# Altium schematic sheet USB - Wireless.SchDoc: USB - Wireless
size A3; Author: Vi Tín; SheetNumber: 10; SheetTotal: 15
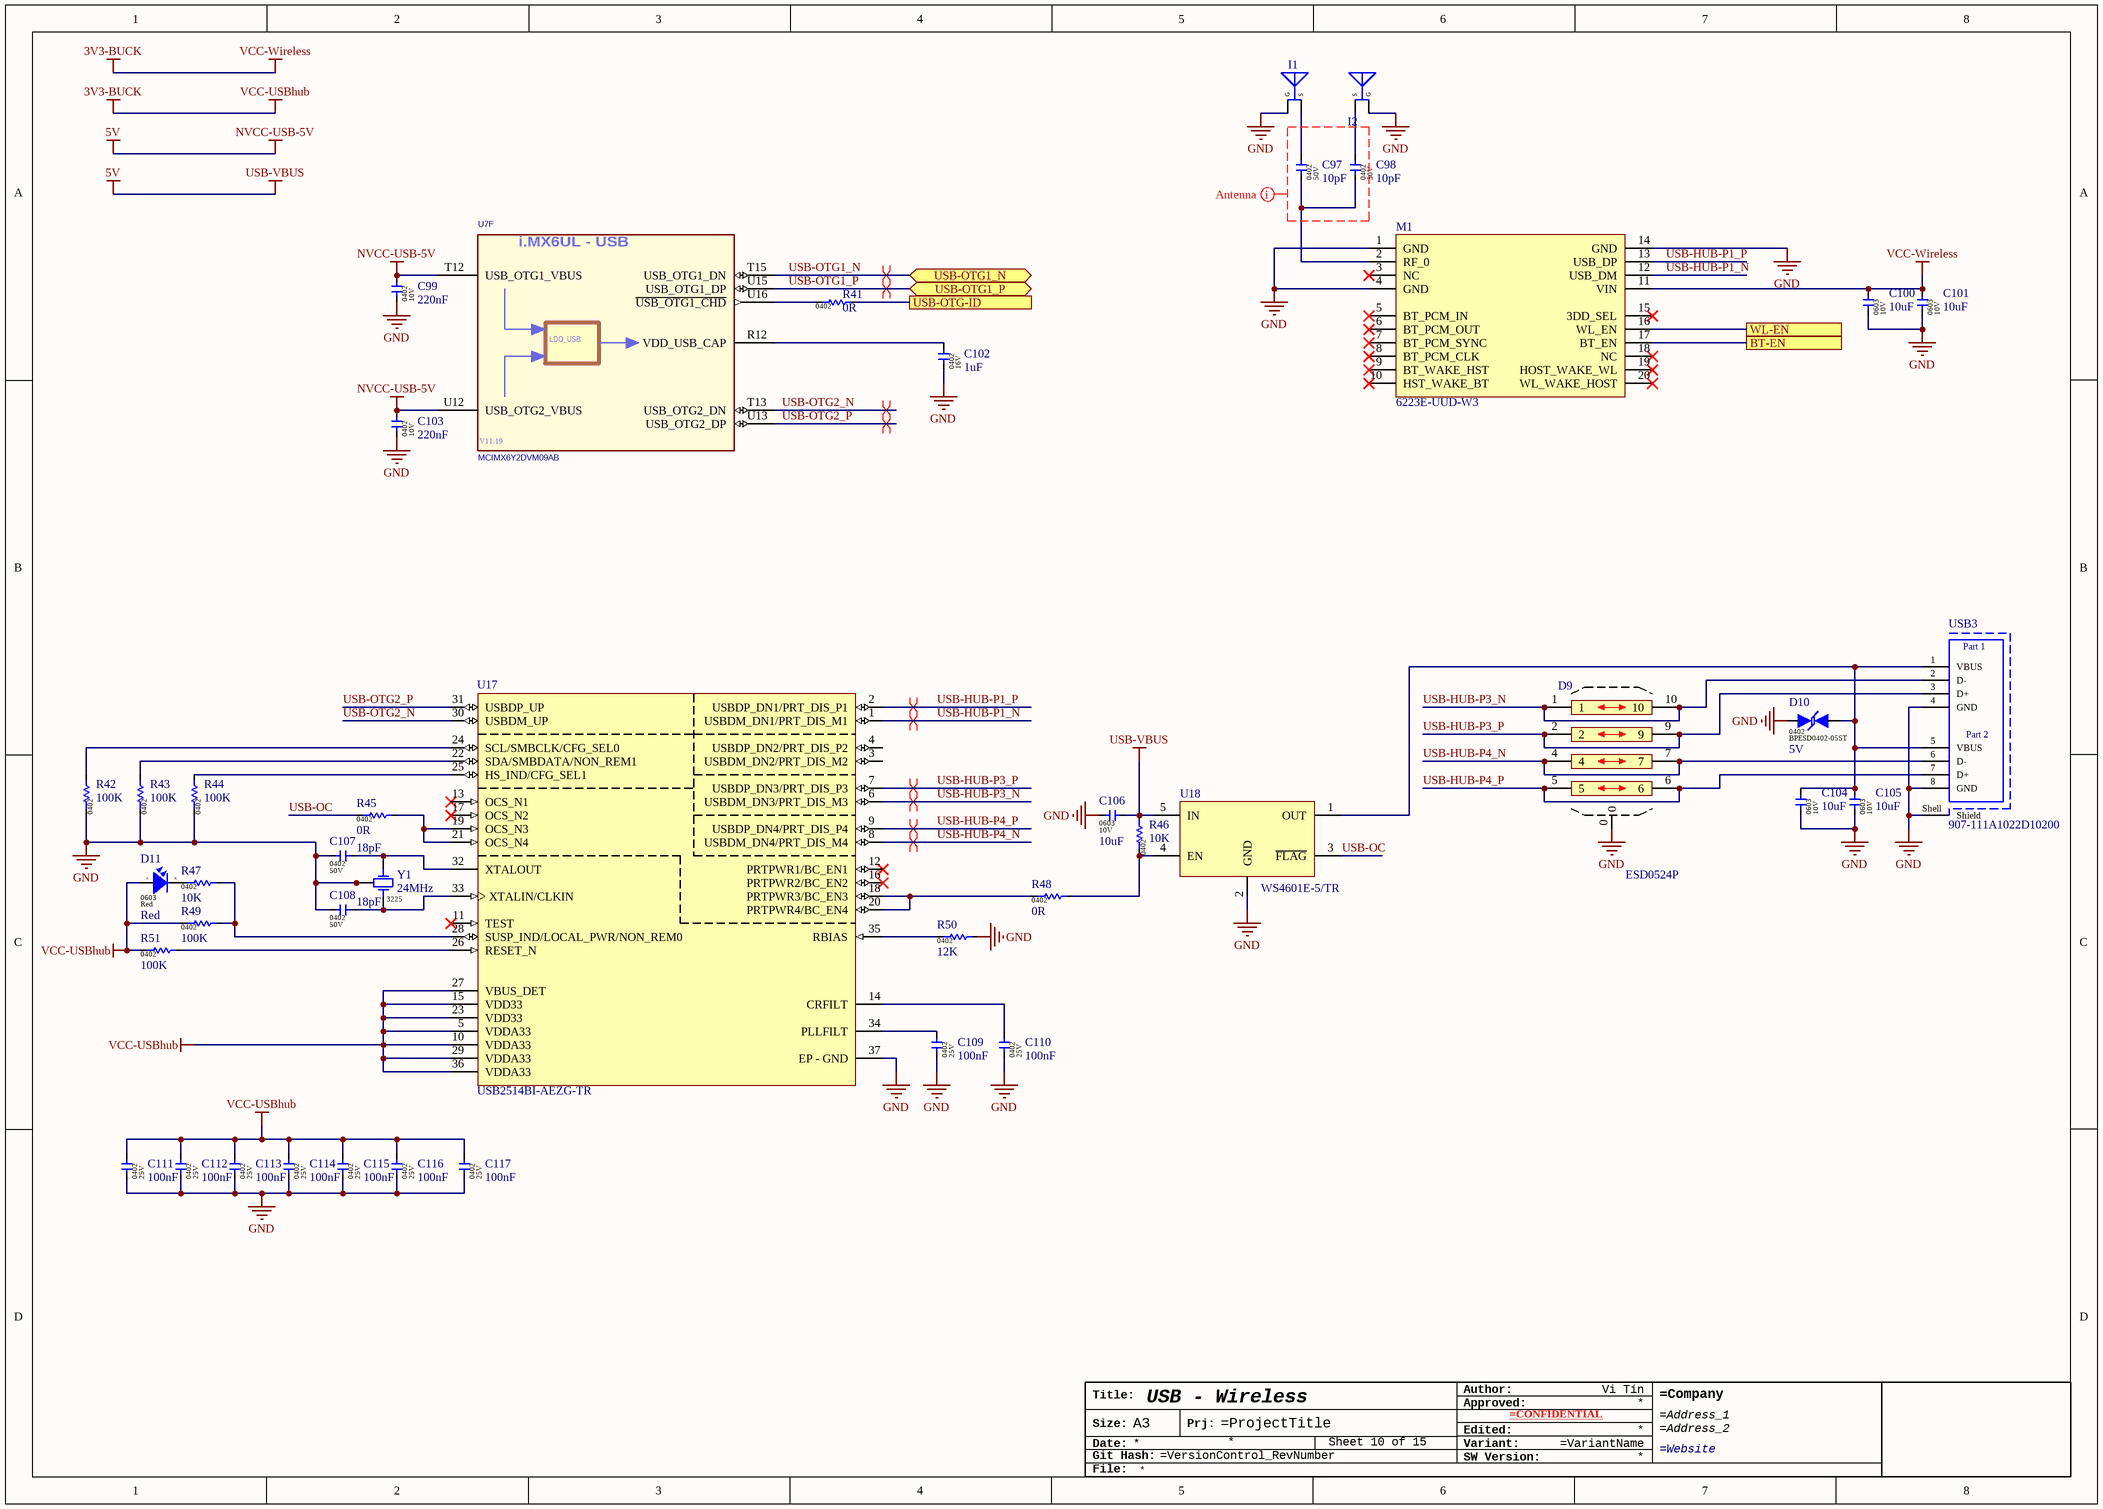
[diagram p0: USB - Wireless.SchDoc]

## Parts
*?  TitleBlock_Generic  (value not drawn)  (graphical)
C97  10pF  [CAP-0402]
C98  10pF  [CAP-0402]
C99  220nF  [CAP-0402]
C100  10uF  [CAP-0603]
C101  10uF  [CAP-0603]
C102  1uF  [CAP-0402]
C103  220nF  [CAP-0402]
C104  10uF  [CAP-0603]
C105  10uF  [CAP-0603]
C106  10uF  [CAP-0603]
C107  18pF  [CAP-0402]
C108  18pF  [CAP-0402]
C109  100nF  [CAP-0402]
C110  100nF  [CAP-0402]
C111  100nF  [CAP-0402]
C112  100nF  [CAP-0402]
C113  100nF  [CAP-0402]
C114  100nF  [CAP-0402]
C115  100nF  [CAP-0402]
C116  100nF  [CAP-0402]
C117  100nF  [CAP-0402]
D9  ESD0524P  [DFN2510]
D10  5V  [Diode-0402]
D11  Red  [LED-0603 RED]
I1  SP-RF-001  [ipex 2.6x2.6]  (value not drawn)
I2  AN043  [PCB antenna - AN043]  (value not drawn)  (net tie, no BOM)
M1  6223E-UUD-W3  [RTL8723DU Module]
R41  0R  [RES-0402]
R42  100K  [RES-0402]
R43  100K  [RES-0402]
R44  100K  [RES-0402]
R45  0R  [RES-0402]
R46  10K  [RES-0402]
R47  10K  [RES-0402]
R48  0R  [RES-0402]
R49  100K  [RES-0402]
R50  12K  [RES-0402]
R51  100K  [RES-0402]
U7  MCIMX6Y2DVM09AB  [IMX6ULL]  (part F of 11)
U17  USB2514BI-AEZG-TR  [QFN36-6X6MM_PAD]
U18  WS4601E-5/TR  [SOT23-5]
USB3  907-111A1022D10200  [2 Female USB]
Y1  24MHz  [Crystal-3225]

## Ports
BT-EN, USB-OTG1_N (bidir), USB-OTG1_P (bidir), USB-OTG-ID, WL-EN

## Nets
3V3-BUCK: C100.2 C101.2 C111.2 C112.2 C113.2 C114.2 C115.2 C116.2 C117.2 D11.2(Anode) M1.11(VIN) R49.1 R51.1 U17.5(VDDA33) U17.10(VDDA33) U17.15(VDD33) U17.23(VDD33) U17.27(VBUS_DET) U17.29(VDDA33) U17.36(VDDA33)  [also labelled VCC-USBhub, VCC-Wireless]
5V: C99.2 C103.2 C106.2 R46.2 U7.T12(USB_OTG1_VBUS) U7.U12(USB_OTG2_VBUS) U18.5(IN)  [also labelled NVCC-USB-5V, USB-VBUS]
GND: C99.1 C100.1 C101.1 C102.1 C103.1 C104.1 C105.1 C106.1 C107.1 C108.1 C109.1 C110.1 C111.1 C112.1 C113.1 C114.1 C115.1 C116.1 C117.1 D9.0 D10.1 I1.0(G) I2.0(G) M1.1(GND) M1.4(GND) M1.14(GND) R42.1 R43.1 R44.1 R50.2 U17.37(EP_-_GND) U18.2(GND) USB3.4(GND) USB3.8(GND) USB3.Shell(Shield) Y1.2(GND) Y1.4(GND)
BT-EN: M1.17(BT_EN) ; port BT-EN
USB-HUB-P1_N: M1.12(USB_DM) U17.1(USBDM_DN1/PRT_DIS_M1)
USB-HUB-P1_P: M1.13(USB_DP) U17.2(USBDP_DN1/PRT_DIS_P1)
USB-HUB-P3_N: D9.1 D9.10 U17.6(USBDM_DN3/PRT_DIS_M3) USB3.2(D-)
USB-HUB-P3_P: D9.2 D9.9 U17.7(USBDP_DN3/PRT_DIS_P3) USB3.3(D+)
USB-HUB-P4_N: D9.4 D9.7 U17.8(USBDM_DN4/PRT_DIS_M4) USB3.6(D-)
USB-HUB-P4_P: D9.5 D9.6 U17.9(USBDP_DN4/PRT_DIS_P4) USB3.7(D+)
USB-OC: R45.1 U18.3(~{FLAG})
USB-OTG1_N: U7.T15(USB_OTG1_DN) ; port USB-OTG1_N
USB-OTG1_P: U7.U15(USB_OTG1_DP) ; port USB-OTG1_P
USB-OTG2_N: U7.T13(USB_OTG2_DN) U17.30(USBDM_UP)
USB-OTG2_P: U7.U13(USB_OTG2_DP) U17.31(USBDP_UP)
USB-OTG-ID: R41.2 ; port USB-OTG-ID
WL-EN: M1.16(WL_EN) ; port WL-EN
NetC97_1: C97.1 C98.1 M1.2(RF_0)
NetC97_2: C97.2 I1.1(S)
NetC98_2: C98.2 I2.1(S)
NetC102_2: C102.2 U7.R12(VDD_USB_CAP)
NetC104_2: C104.2 C105.2 D10.2 U18.1(OUT) USB3.1(VBUS) USB3.5(VBUS)
NetC107_2: C107.2 U17.32(XTALOUT) Y1.1(X1)
NetC108_2: C108.2 U17.33(XTALIN/CLKIN) Y1.3(X2)
NetC109_2: C109.2 U17.34(PLLFILT)
NetC110_2: C110.2 U17.14(CRFILT)
NetD11_1: D11.1(Cathode) R47.1
NetR41_1: R41.1 U7.U16(~{USB_OTG1_CHD})
NetR42_2: R42.2 U17.24(SCL/SMBCLK/CFG_SEL0)
NetR43_2: R43.2 U17.22(SDA/SMBDATA/NON_REM1)
NetR44_2: R44.2 U17.25(HS_IND/CFG_SEL1)
NetR45_2: R45.2 U17.19(OCS_N3) U17.21(OCS_N4)
NetR46_1: R46.1 R48.2 U18.4(EN)
NetR47_2: R47.2 R49.2 U17.28(SUSP_IND/LOCAL_PWR/NON_REM0)
NetR48_1: R48.1 U17.18(PRTPWR3/BC_EN3) U17.20(PRTPWR4/BC_EN4)
NetR50_1: R50.1 U17.35(RBIAS)
NetR51_2: R51.2 U17.26(RESET_N)

Not connected (* = marked no-connect by the designer): M1 3(NC)* 5(BT_PCM_IN)* 6(BT_PCM_OUT)* 7(BT_PCM_SYNC)* 8(BT_PCM_CLK)* 9(BT_WAKE_HST)* 10(HST_WAKE_BT)* 15(3DD_SEL)* 18(NC)* 19(HOST_WAKE_WL)* 20(WL_WAKE_HOST)*; U17 3(USBDM_DN2/PRT_DIS_M2) 4(USBDP_DN2/PRT_DIS_P2) 11(TEST)* 12(PRTPWR1/BC_EN1)* 13(OCS_N1)* 16(PRTPWR2/BC_EN2)* 17(OCS_N2)*

## Layout directives
differential pair; differential pair class DIFF90_USB: USB-HUB-P1_N, USB-HUB-P1_P, USB-HUB-P3_N, USB-HUB-P3_P, USB-HUB-P4_N, USB-HUB-P4_P, USB-OTG1_N, USB-OTG1_P, USB-OTG2_N, USB-OTG2_P
net class Antenna: (no net found under the mark)

## Notes on the sheet
- (in symbol 19-217/R6C-AL1M2VY/3T) A; K
- (in symbol 907-111A1022D10200) Part 1; Part 2
- (in symbol MCIMX6Y2DVM09AB, part F) i.MX6UL - USB; LDO_USB; V11.19
- (in symbol TitleBlock_Generic) Author:; Title:; Approved:; Size:; A3; Prj:; Edited:; Date:; Variant:; SW Version:; Git Hash:; File:

## Library data of the parts
C97 C98 = 0402N100J500CT: 10pF ±5% 50V NP0 0402 Multilayer Ceramic Capacitors MLCC - SMD/SMT RoHS; Manufacture: WALSIN; Package / Case: 0402; Component type: Capacitor; Manufacture part: 0402N100J500CT; Capacitor value: 10pF; Voltage: 50V; Package: 0402
C99 C103 = 0402X224J100CT: 220nF ±5% 10V X5R 0402 Multilayer Ceramic Capacitors MLCC - SMD/SMT RoHS; Manufacture: WALSIN; Package / Case: 0402; Component type: Capacitor; Manufacture part: 0402X224J100CT; Capacitor value: 220nF; Voltage: 10V; Package: 0402
C100 C101 C104-C106 = 0603X106M100CT: 10uF ±20% 10V X5R 0603 Multilayer Ceramic Capacitors MLCC - SMD/SMT RoHS; Manufacture: WALSIN; Package / Case: 0402; Component type: Capacitor; Manufacture part: 0603X106M100CT; Capacitor value: 10uF; Voltage: 10V; Package: 0603
C102 = 0402X105K160CT: 1uF ±10% 16V X5R 0402 Multilayer Ceramic Capacitors MLCC - SMD/SMT RoHS; Manufacture: WALSIN; Package / Case: 0402; Component type: Capacitor; Manufacture part: 0402X105K160CT; Capacitor value: 1uF; Voltage: 16V; Package: 0402
C107 C108 = 0402N180J500CT: 18pF ±5% 50V NP0 0402 Multilayer Ceramic Capacitors MLCC - SMD/SMT RoHS; Manufacture: WALSIN; Package / Case: 0402; Component type: Capacitor; Manufacture part: 0402N180J500CT; Capacitor value: 18pF; Voltage: 50V; Package: 0402
C109-C117 = 0402X104K250CT: 100nF ±10% 25V X5R 0402 Multilayer Ceramic Capacitors MLCC - SMD/SMT RoHS; Manufacture: WALSIN; Package / Case: 0402; Component type: Capacitor; Manufacture part: 0402X104K250CT; Capacitor value: 100nF; Voltage: 25V; Package: 0402
D9 = ESD0524P: DFN2510 ESD Protection Devices ROHS; Manufacture: MDD（Microdiode Electronics）; Type: TVS/ESD Bi diode; Diode value: 5V; Manufacture part: ESD0524P; Package: DFN2510; Datasheet: https://datasheet.lcsc.com/lcsc/2009281808_MDD-Microdiode-Electronics--ESD0524P_C840786.pdf
D10 = BPESD0402-05ST: Bidirectional 40V 5V (Max) 0402 ESD Protection Devices ROHS; Manufacture: BORN; Manufacture part: BPESD0402-05ST; Type: TVS/ESD Bi diode; Diode value: 5V; Package: 0402; Datasheet: https://datasheet.lcsc.com/lcsc/1811031631_BORN-BPESD0402-05ST_C316059.pdf
D11 = 19-217/R6C-AL1M2VY/3T: Red 617.5~633.5nm 0603 Light Emitting Diodes (LED) RoHS; Manufacture: Everlight Elec; Package / Case: 0402; Component type: Led; Part reference: *; Manufacture part: 19-217/R6C-AL1M2VY/3T; Color: Red; Package: 0603
I1 = SP-RF-001: 2.6x2.6x1.25mm RF Connectors/Coaxial Connectors RoHS; Manufacture: XUNPU; Manufacture part: SP-RF-001; Type: IPEX; Datasheet: https://datasheet.lcsc.com/lcsc/2012251035_XUNPU-SP-RF-001_C920232.pdf
I2 = AN043: AN043 F-2.4Ghz BW-101Mhz 15x6mm; Manufacture part: AN043; Manufacture: N/A; Type: PCB Antenna; Datasheet: https://www.ti.com/lit/an/swra351a/swra351a.pdf?ts=1625122688525&ref_url=https%253A%252F%252Fwww.google.com%252F
M1 = 6223E-UUD-W3: USB 2.4GHz WiFi Bluetooth Module; Manufacture: FN-LINK; Manufacture part: 6223E-UUD-W3; Package: N/A
R41 R45 R48 = WR04X0000FTL: 0Ω ±1% 1/16W -200ppm/℃~+400ppm/℃ 0402 Chip Resistor - Surface Mount RoHS; Manufacture: WALSIN; Package / Case: 0201; Component type: Resistor; Manufacture part: WR04X0000FTL; Resistor value: 0R; Package: 0402
R42-R44 R49 R51 = WR04X1003FTL: 100kΩ ±1% 1/16W ±100ppm/℃ 0402 Chip Resistor - Surface Mount RoHS; Manufacture: WALSIN; Package / Case: 0201; Component type: Resistor; Manufacture part: WR04X1003FTL; Resistor value: 100K; Package: 0402
R46 R47 = WR04X1002FTL: 10kΩ ±1% 1/16W ±100ppm/℃ 0402 Chip Resistor - Surface Mount RoHS; Manufacture: WALSIN; Package / Case: 0201; Component type: Resistor; Manufacture part: WR04X1002FTL; Resistor value: 10K; Package: 0402
R50 = WR04X1202FTL: 12kΩ ±1% 1/16W ±100ppm/℃ 0402 Chip Resistor - Surface Mount RoHS; Manufacture: WALSIN; Package / Case: 0201; Component type: Resistor; Manufacture part: WR04X1202FTL; Resistor value: 12K; Package: 0402
U7 = MCIMX6Y2DVM09AB: Microprocessors - MPU i.MX 32-bit MPU ARM -A7 900MHz, 0.8mm Pitch; Manufacture: NXP Semiconductors; CLASS: IC; CAD_APPROVED: Yes; PRE_APN: 330-76997; MFG_PN01: PCIMX6G3CVM05AA; MFG_NAME01: FREESCALE SEMICONDUCTOR; AGILE_PN: TMP-WF-23753; HEIGHT: 1.37 MM; ROHS: Yes; Manufacture part: MCIMX6Y2DVM09AB; Package: MAPBGA-289 (14x14); Datasheet: https://www.mouser.vn/datasheet/2/302/IMX6ULLCEC-1126331.pdf
U17 = USB2514BI-AEZG-TR: USB Hub Controller USB USB 2.0 3V ~ 3.6V QFN-36_6x6x05P Interface - Controllers RoHS; Manufacture: Microchip Tech; Manufacture part: USB2514BI-AEZG-TR; Package: QFN-36 (6x6); Datasheet: https://datasheet.lcsc.com/lcsc/1809192317_Microchip-Tech-USB2514BI-AEZG-TR_C58940.pdf
U18 = WS4601E-5/TR: 5.5V, 1.5A Power Distribution Switches ROHS; Manufacture: WILLSEMI(Will Semicon); Manufacture part: WS4601E-5/TR; Package: SOT23-5; Datasheet: https://datasheet.lcsc.com/lcsc/1912301231_WILLSEMI-Will-Semicon-WS4601E-5-TR_C213171.pdf
USB3 = 907-111A1022D10200: USB - Type A Female USB 2.0 8 Through Hole USB Connectors RoHS; Manufacture: Jing Extension of the Electronic Co.; Manufacture part: 907-111A1022D10200; Type: USB-A; Datasheet: https://datasheet.lcsc.com/lcsc/2102261732_Jing-Extension-of-the-Electronic-Co-907-111A1022D10200_C12049.pdf
Y1 = SX32Y024000BC1T: 24MHz ±10ppm 12pF 40Ω SMD-3225 Crystals RoHS; Manufacture: TKD; Manufacture part: SX32Y024000BC1T; Crystal value: 24MHz; Package: 3225
*? = TitleBlock_Generic: Manufacture part: TitleBlock_Generic; Manufacture: N/A; Type: Graphic